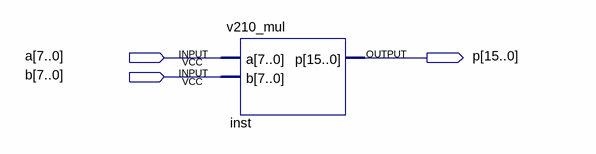
[diagram p0: schematic sheet]
// Quartus schematic vs210_mul.bdf as structural Verilog: 1 symbols, 3 pins
module vs210_mul (
  input  [7:0] a,
  input  [7:0] b,
  output [15:0] p
);

  v210_mul inst (.a(a), .b(b), .p(p));
endmodule
